# EAGLE design mb_01-3 (EAGLE 7.7.0)
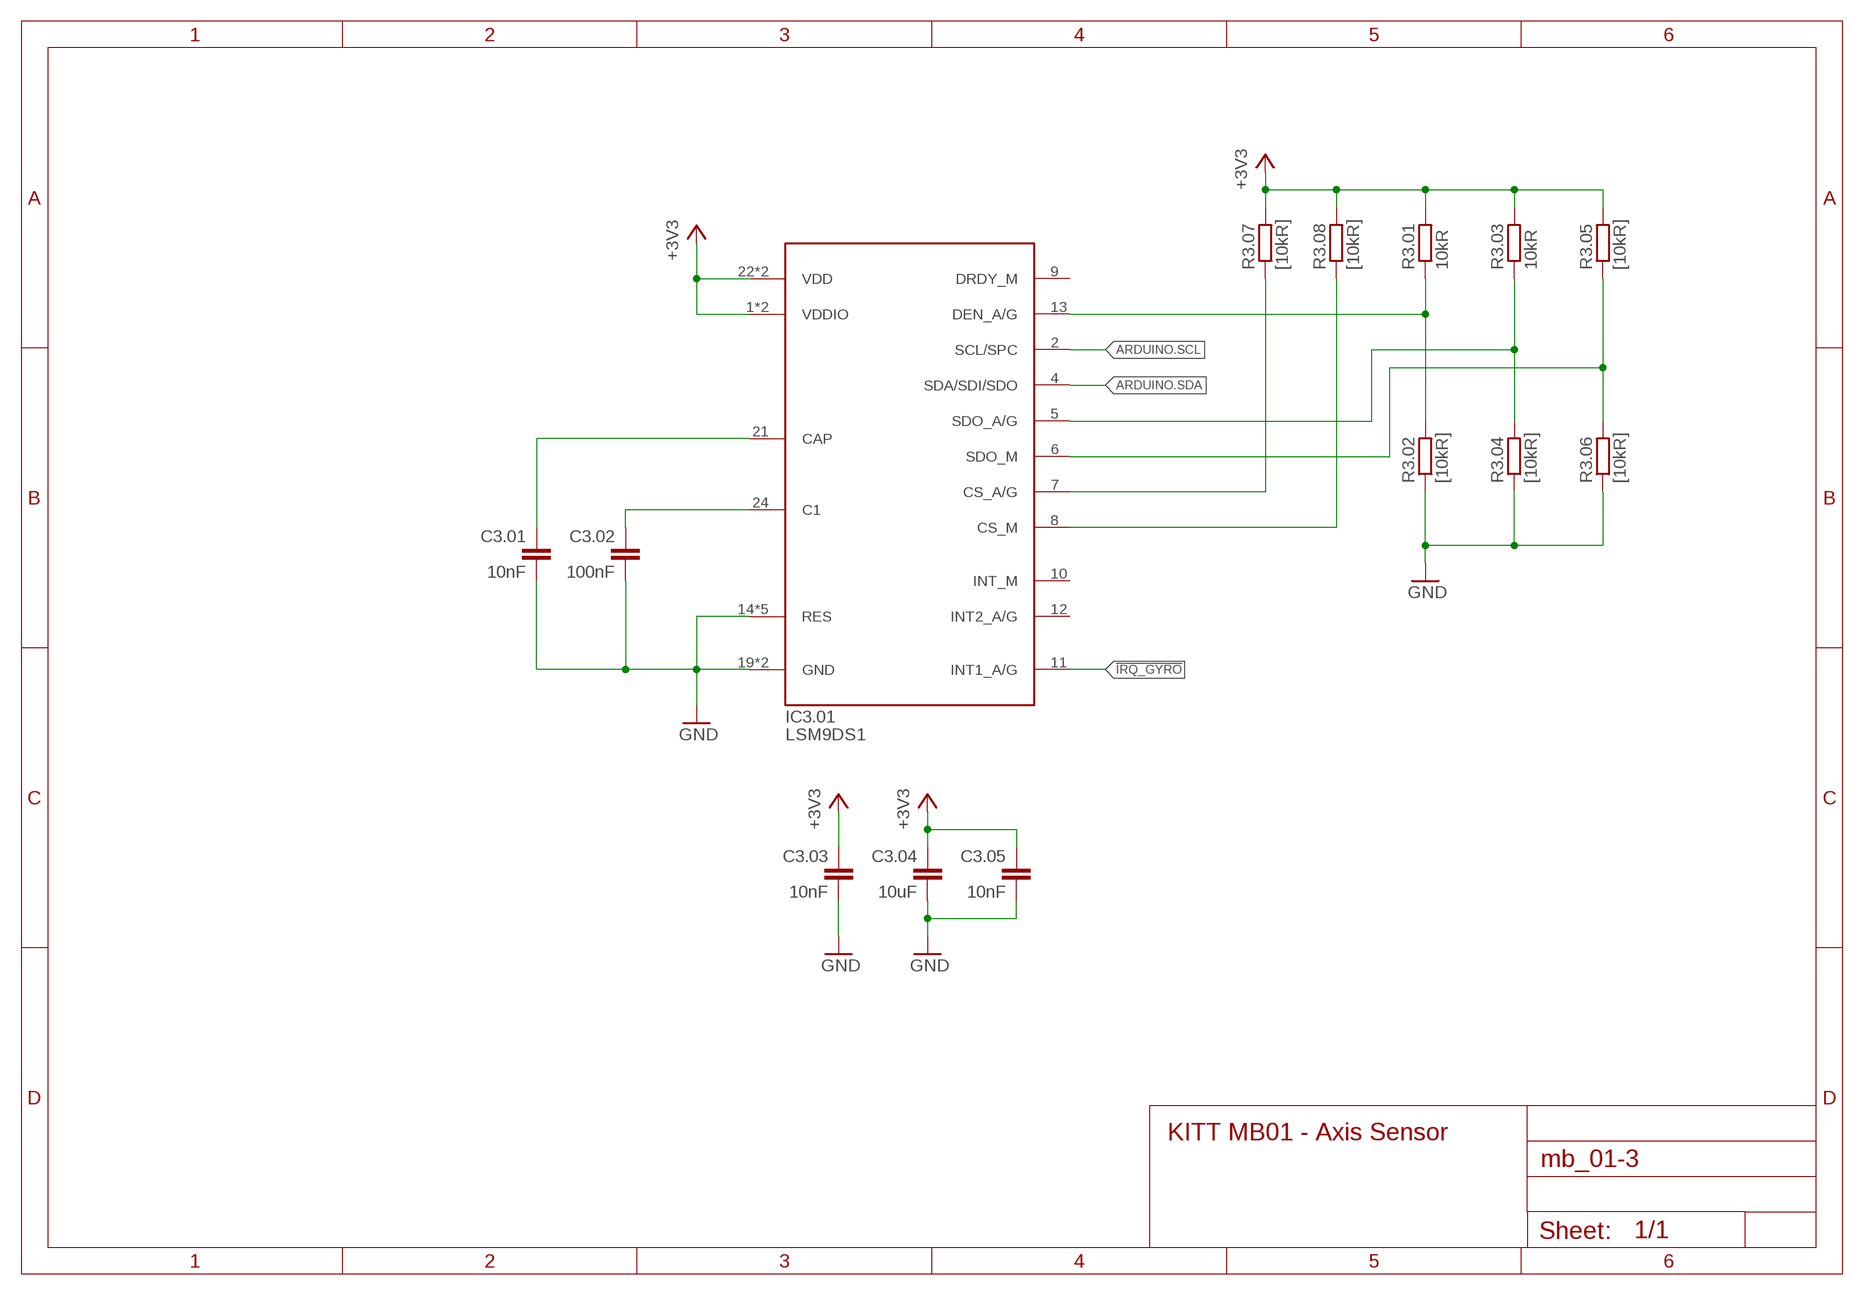
[diagram p0: schematic, sheet 1]

## Parts
C3.01  10nF  C-EUC0402  [C0402]
C3.02  100nF  C-EUC0402  [C0402]
C3.03  10nF  C-EUC0402  [C0402]
C3.04  10uF  C-EUC0603K  [C0603K]
C3.05  10nF  C-EUC0402  [C0402]
IC3.01  LSM9DS1  [LGA-24]
R3.01  10kR  R-EU_R0402  [R0402]
R3.02  [10kR]  R-EU_R0402  [R0402]
R3.03  10kR  R-EU_R0402  [R0402]
R3.04  [10kR]  R-EU_R0402  [R0402]
R3.05  [10kR]  R-EU_R0402  [R0402]
R3.06  [10kR]  R-EU_R0402  [R0402]
R3.07  [10kR]  R-EU_R0402  [R0402]
R3.08  [10kR]  R-EU_R0402  [R0402]

## Nets
!IRQ_GYRO: IC3.01.11(INT1_A/G)
+3V3: C3.03.1 C3.04.1 C3.05.1 IC3.01.1(VDDIO) IC3.01.3(VDDIO) IC3.01.22(VDD) IC3.01.23(VDD) R3.01.2 R3.03.2 R3.05.2 R3.07.2 R3.08.2
GND: C3.01.2 C3.02.2 C3.03.2 C3.04.2 C3.05.2 IC3.01.14(RES) IC3.01.15(RES) IC3.01.16(RES) IC3.01.17(RES) IC3.01.18(RES) IC3.01.19(GND) IC3.01.20(GND) R3.02.1 R3.04.1 R3.06.1
N$1: C3.01.1 IC3.01.21(CAP)
N$6: C3.02.1 IC3.01.24(C1)
N$17: IC3.01.13(DEN_A/G) R3.01.1 R3.02.2
N$23: IC3.01.5(SDO_A/G) R3.03.1 R3.04.2
N$24: IC3.01.7(CS_A/G) R3.07.1
N$26: IC3.01.6(SDO_M) R3.05.1 R3.06.2
N$27: IC3.01.8(CS_M) R3.08.1
Unconnected: IC3.01.2(SCL/SPC) IC3.01.4(SDA/SDI/SDO) IC3.01.9(DRDY_M) IC3.01.10(INT_M) IC3.01.12(INT2_A/G)

## Notes on the sheet
- KITT MB01 - Axis Sensor

## Library data of the parts
C3.01-C3.05 = rcl:C-EU: CAPACITOR, European symbol
IC3.01 = kitt.ic:LSM9DS1; AVAILABILITY: Unavailable; DESCRIPTION: iNEMO inertial module: 3D accelerometer, 3D gyroscope, 3D magnetometer; MF: STMicroelectronics; MP: LSM9DS1; PACKAGE: None; PRICE: None
R3.01-R3.08 = rcl:R-EU_: RESISTOR, European symbol

## Board
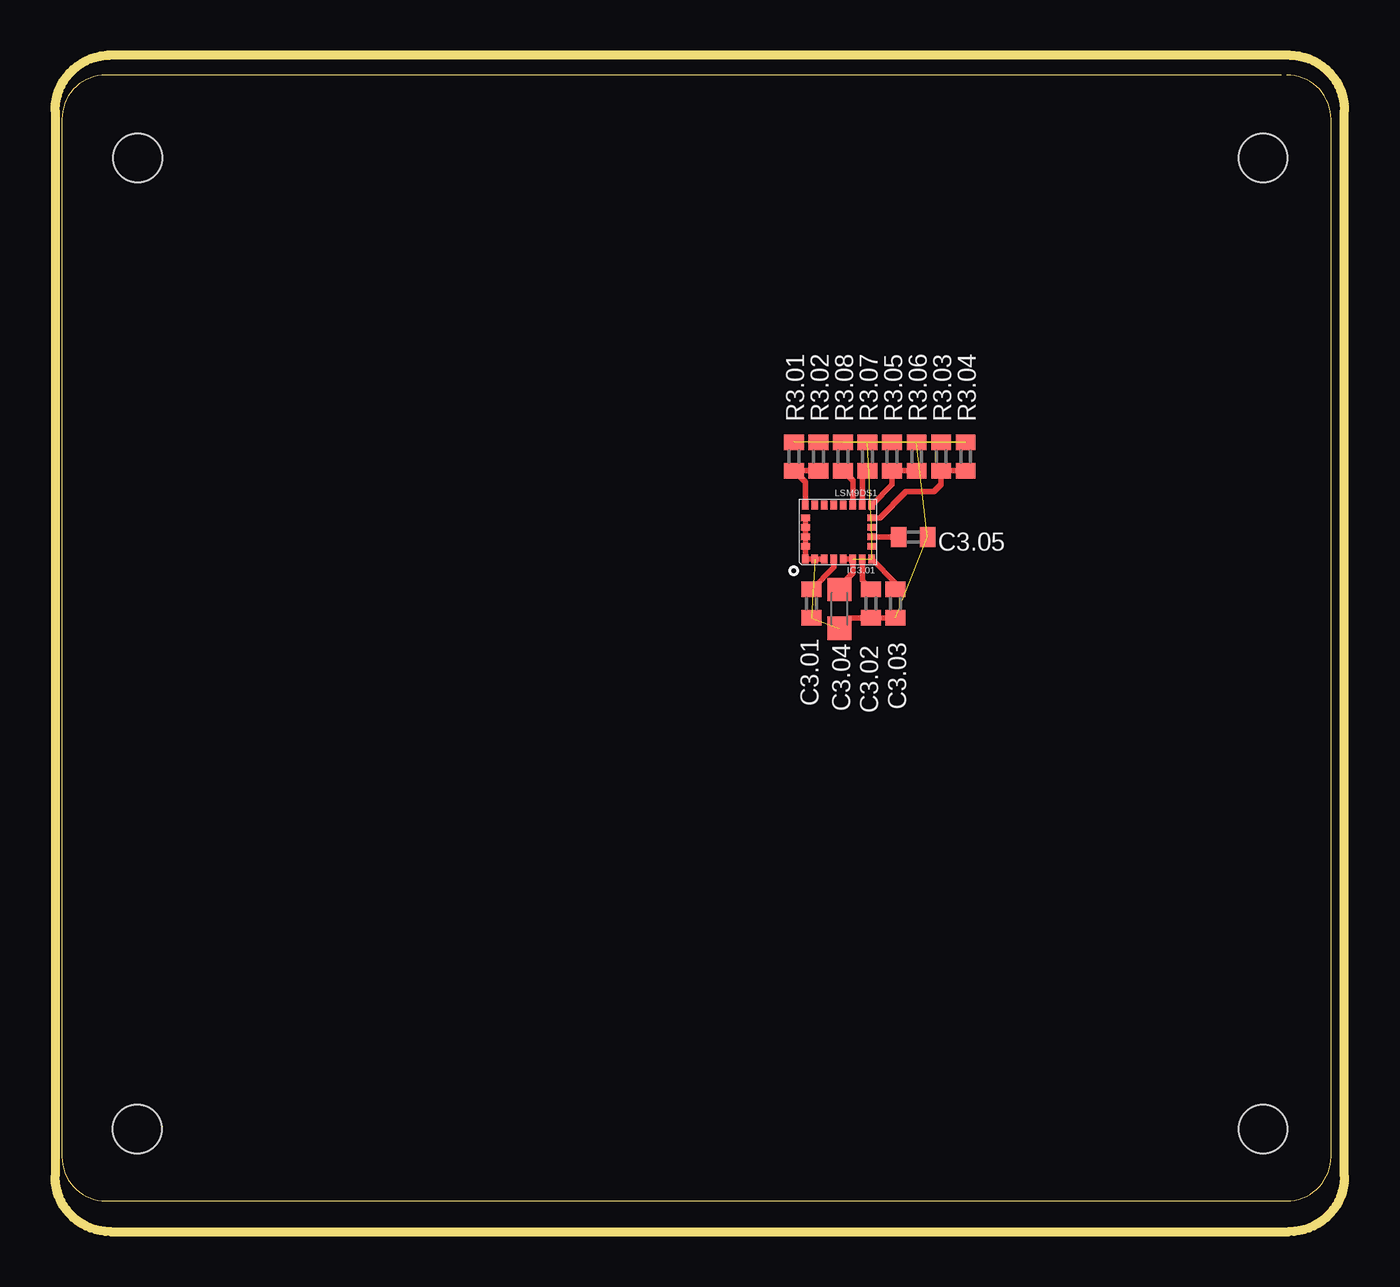
[diagram p1: board, top side]

Size 58.4 x 53.3 mm. Coordinates in mm from the lower left corner, seen from the top.
Outline: 55.55,52.4 2.3,52.4 arc90 0.3,50.4 0.3,3.4 arc90 2.3,1.4 55.8,1.4 arc90 57.8,3.4 57.8,50.4 arc90 55.8,52.4
Outline: 2.5,53.3 arc90 0,50.8 0,2.5 arc90 2.5,0 55.9,0 arc90 58.4,2.5 58.4,50.8 arc90 55.9,53.3 2.4,53.3
Copper layers (1*2+3*4+5*6+7*16): Top 0.035mm / dielectric 0.2mm / Route2 0.035mm / dielectric 0.15mm / Route3 0.035mm / dielectric 0.2mm / layer 4 0.035mm / dielectric 0.15mm / layer 5 0.035mm / dielectric 0.2mm / layer 6 0.035mm / dielectric 0.15mm / layer 7 0.035mm / dielectric 0.2mm / Bottom 0.035mm
Design rules "default *": minimum track width 6mil, minimum drill 0.25mm, track to track 6mil, track to pad 8mil, pad to pad 8mil, via to via 6mil, smd to smd 8mil, copper to edge 12mil, drill to drill 24mil, minimum pad ring 9mil, minimum via ring 9mil, stop-mask expansion 3mil, vias tented up to drill 0mil, thermal gap 12mil
Holes 2.2 mm at 3.72,4.65 54.72,4.65 3.74,48.64 54.72,48.64
Milling: 4 lines

### Footprints (pad centres in the part's own frame; a part is rotated, then mirrored left to right if it is on the bottom)
C0402 = smd 0.7 x 0.9: 1 -0.65,0; 2 0.65,0
C0603K = smd 1.05 x 1.08: 1 -0.875,0; 2 0.875,0
LGA-24 = smd 0.29 x 0.4: 1 -0.025,2.45; 6 -0.025,0; 7 0.405,0; 8 0.835,0; 9 1.264,0; 10 1.694,0; 11 2.124,0; 12 2.554,0; 13 2.985,0; 18 2.985,2.45; 19 2.554,2.45; 20 2.124,2.45; 21 1.694,2.45; 22 1.264,2.45; 23 0.835,2.45; 24 0.405,2.45 | smd 0.4 x 0.29: 2 -0.025,1.87; 3 -0.025,1.44; 4 -0.025,1.01; 5 -0.025,0.58; 14 2.985,0.58; 15 2.985,1.01; 16 2.985,1.44; 17 2.985,1.87
R0402 = smd 0.7 x 0.9: 1 -0.65,0; 2 0.65,0

### Placement (x,y rotation side)
C3.01  34.26,28.45 270 top
C3.02  36.96,28.45 270 top
C3.03  100nF  [C0402]  38.07,28.45 270 top
C3.04  35.52,28.21 270 top
C3.05  100nF  [C0402]  38.87,31.47 0 top
IC3.01  36.97,32.92 180 top
R3.01  33.47,35.12 90 top
R3.02  34.58,35.12 270 top
R3.03  40.14,35.12 90 top
R3.04  41.25,35.12 270 top
R3.05  37.91,35.12 90 top
R3.06  39.02,35.12 270 top
R3.07  36.8,35.12 90 top
R3.08  35.69,35.12 90 top
U$1  [REF_GCB2_TS]  4.42,5.12 0 top

### Tracks (layer width: path | path; a pad name or v marks a point on that pad's centre or on a via)
+3V3  (7 unrouted)
  Top 0.254: C3.04.1 35.52,29.24 36.13,29.85 IC3.01.23 IC3.01.22 | IC3.01.1 38.07,29.39 C3.03.1 | IC3.01.3 arc90 37,31.47 C3.05.1
GND  (6 unrouted)
  Top 0.254: C3.03.2 C3.02.2 35.99,27.8 C3.04.2 | IC3.01.20 IC3.01.19 IC3.01.18 IC3.01.17 IC3.01.16 IC3.01.15 IC3.01.14
N$1
  Top 0.254: C3.01.1 34.28,29.1 35.27,30.1 IC3.01.21
N$6
  Top 0.254: C3.02.1 36.56,29.5 IC3.01.24
N$17
  Top 0.254: R3.02.2 R3.01.1 33.98,33.96 IC3.01.13
N$23
  Top 0.254: IC3.01.5 37.35,32.34 38.55,33.53 39.82,33.53 40.14,33.85 R3.03.1 R3.04.2
N$24
  Top 0.254: R3.07.1 36.56,34.23 IC3.01.7
N$26
  Top 0.254: IC3.01.6 37.91,33.84 R3.05.1 R3.06.2
N$27
  Top 0.254: IC3.01.8 36.13,34.03 R3.08.1

### Text on the board
Milling: EAGLE EDU LIMIT
Reference: Motor Leads --> | <-- Rail Power Leads